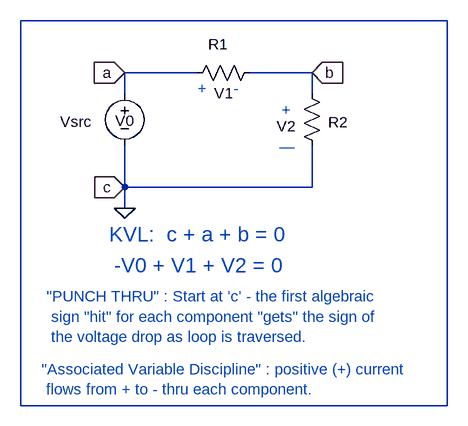
[diagram p0: schematic KVL__single_loop.asc]
KVL__single_loop.asc, the LTspice schematic file:
Version 4
SHEET 1 880 680
WIRE 512 -16 -144 -16
WIRE 128 64 16 64
WIRE 304 64 208 64
WIRE 16 96 16 64
WIRE 304 96 304 64
WIRE 16 240 16 176
WIRE 304 240 304 176
WIRE 304 240 16 240
WIRE 16 272 16 240
WIRE -144 576 -144 -16
WIRE 512 576 512 -16
WIRE 512 576 -144 576
FLAG 16 272 0
FLAG 16 64 a
IOPIN 16 64 In
FLAG 304 64 b
IOPIN 304 64 In
FLAG 16 240 c
IOPIN 16 240 In
SYMBOL res 224 48 R90
WINDOW 0 -12 64 VBottom 2
WINDOW 3 32 56 VTop 2
SYMATTR InstName R1
SYMATTR Value V1
SYMBOL res 320 192 R180
WINDOW 0 -40 52 Left 2
WINDOW 3 41 46 Left 2
SYMATTR InstName R2
SYMATTR Value V2
SYMBOL voltage 16 80 R0
WINDOW 0 -15 58 Left 2
WINDOW 3 -99 59 Left 2
WINDOW 123 0 0 Left 0
WINDOW 39 0 0 Left 0
SYMATTR InstName V0
SYMATTR Value Vsrc
TEXT 128 88 Left 2 ;+      -
TEXT 264 184 VLeft 2 ;|       +
TEXT -8 312 Left 3 ;KVL:  c + a + b = 0
TEXT 0 360 Left 3 ;-V0 + V1 + V2 = 0
TEXT -104 408 Left 2 ;"PUNCH THRU" : Start at 'c' - the first algebraic\n sign "hit" for each component "gets" the sign of\n the voltage drop as loop is traversed.
TEXT -112 520 Left 2 ;"Associated Variable Discipline" : positive (+) current\n flows from + to - thru each component.

The netlist it stands for:
* KVL__single_loop.asc
R1 b a V1
R2 0 b V2
V0 a 0 Vsrc
* +      -
* |       +
* KVL:  c + a + b = 0
* -V0 + V1 + V2 = 0
* "PUNCH THRU" : Start at 'c' - the first algebraic
*  sign "hit" for each component "gets" the sign of
*  the voltage drop as loop is traversed.
* "Associated Variable Discipline" : positive (+) current
*  flows from + to - thru each component.
.backanno
.end